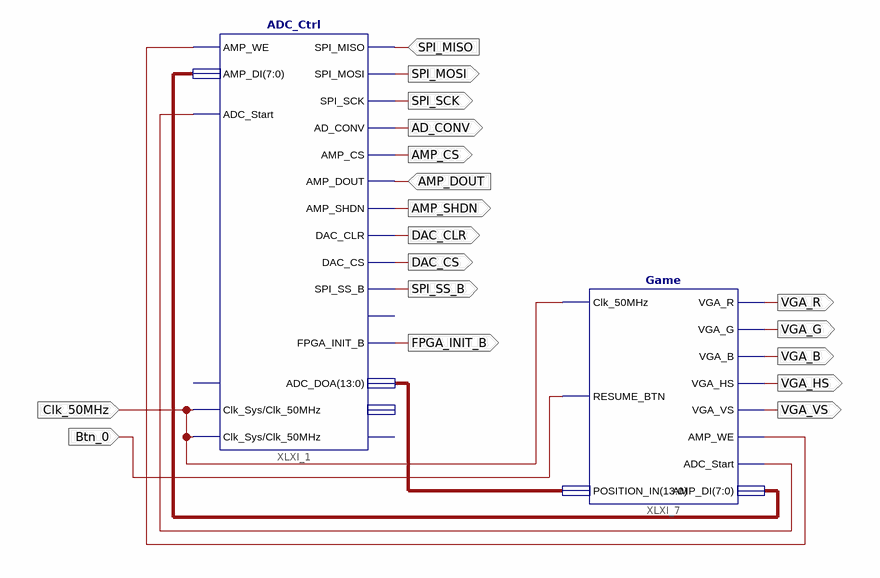
[diagram p0: schematic sheet 1]
// Xilinx ISE schematic GameSchema.sch (spartan3e) as structural Verilog: 2 symbols, 18 ports
module GameSchema (
  input  SPI_MISO,
  input  AMP_DOUT,
  input  Clk_50MHz,
  input  Btn_0,
  output SPI_MOSI,
  output SPI_SCK,
  output AD_CONV,
  output AMP_CS,
  output AMP_SHDN,
  output DAC_CLR,
  output DAC_CS,
  output SPI_SS_B,
  output FPGA_INIT_B,
  output VGA_VS,
  output VGA_HS,
  output VGA_B,
  output VGA_G,
  output VGA_R
);

  wire XLXN_131, XLXN_132;
  wire [7:0] XLXN_33;
  wire [13:0] Line;

  ADC_Ctrl XLXI_1 (
    .Clk_Sys(Clk_50MHz), .AMP_WE(XLXN_131), .ADC_Start(XLXN_132), .SPI_MISO(SPI_MISO), .AMP_DOUT(AMP_DOUT),
    .AMP_DI(XLXN_33), .SPI_MOSI(SPI_MOSI), .SPI_SCK(SPI_SCK), .AMP_CS(AMP_CS), .AMP_SHDN(AMP_SHDN),
    .AD_CONV(AD_CONV), .DAC_CS(DAC_CS), .DAC_CLR(DAC_CLR), .SPI_SS_B(SPI_SS_B), .FPGA_INIT_B(FPGA_INIT_B),
    .ADC_DOA(Line), .Clk_50MHz(Clk_50MHz));  // open: Busy, SF_CE0, ADC_DOB, Reset
  Game XLXI_7 (
    .Clk_50MHz(Clk_50MHz), .RESUME_BTN(Btn_0), .POSITION_IN(Line), .VGA_R(VGA_R), .VGA_G(VGA_G),
    .VGA_B(VGA_B), .VGA_HS(VGA_HS), .VGA_VS(VGA_VS), .AMP_WE(XLXN_131), .ADC_Start(XLXN_132), .AMP_DI(XLXN_33));
endmodule
